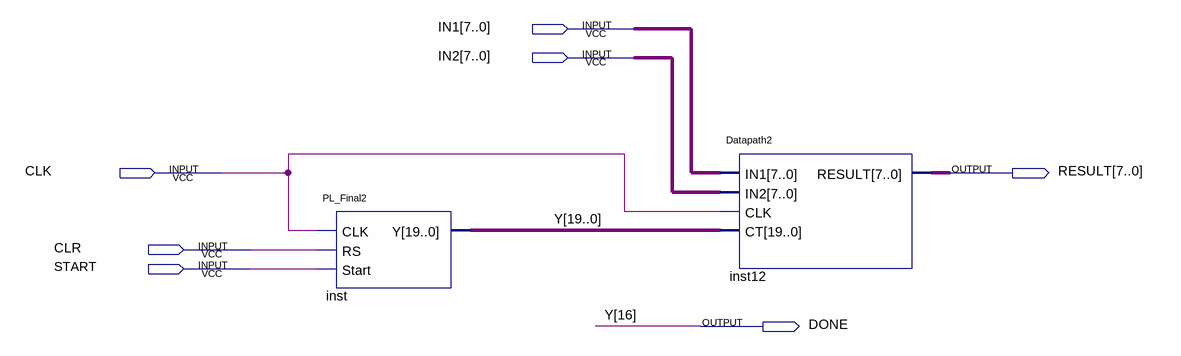
[diagram p0: schematic sheet]
// Quartus schematic final2.bdf as structural Verilog: 2 symbols, 7 pins
module final2 (
  input  [7:0] IN1,
  input  [7:0] IN2,
  input  CLK,
  input  CLR,
  input  START,
  output [7:0] RESULT,
  output DONE
);

  wire [19:0] Y;

  PL_Final2 inst (.CLK(CLK), .RS(CLR), .Start(START), .Y({Y[19:17], DONE, Y[15:0]}));
  Datapath2 inst12 (.IN1(IN1), .IN2(IN2), .CLK(CLK), .CT({Y[19:17], DONE, Y[15:0]}), .RESULT(RESULT));

  // Other names for the same wires on the sheet: Y[16] = DONE
endmodule
